# Altium schematic sheet MCU.SchDoc
size A4; SheetNumber: 3; SheetTotal: 7
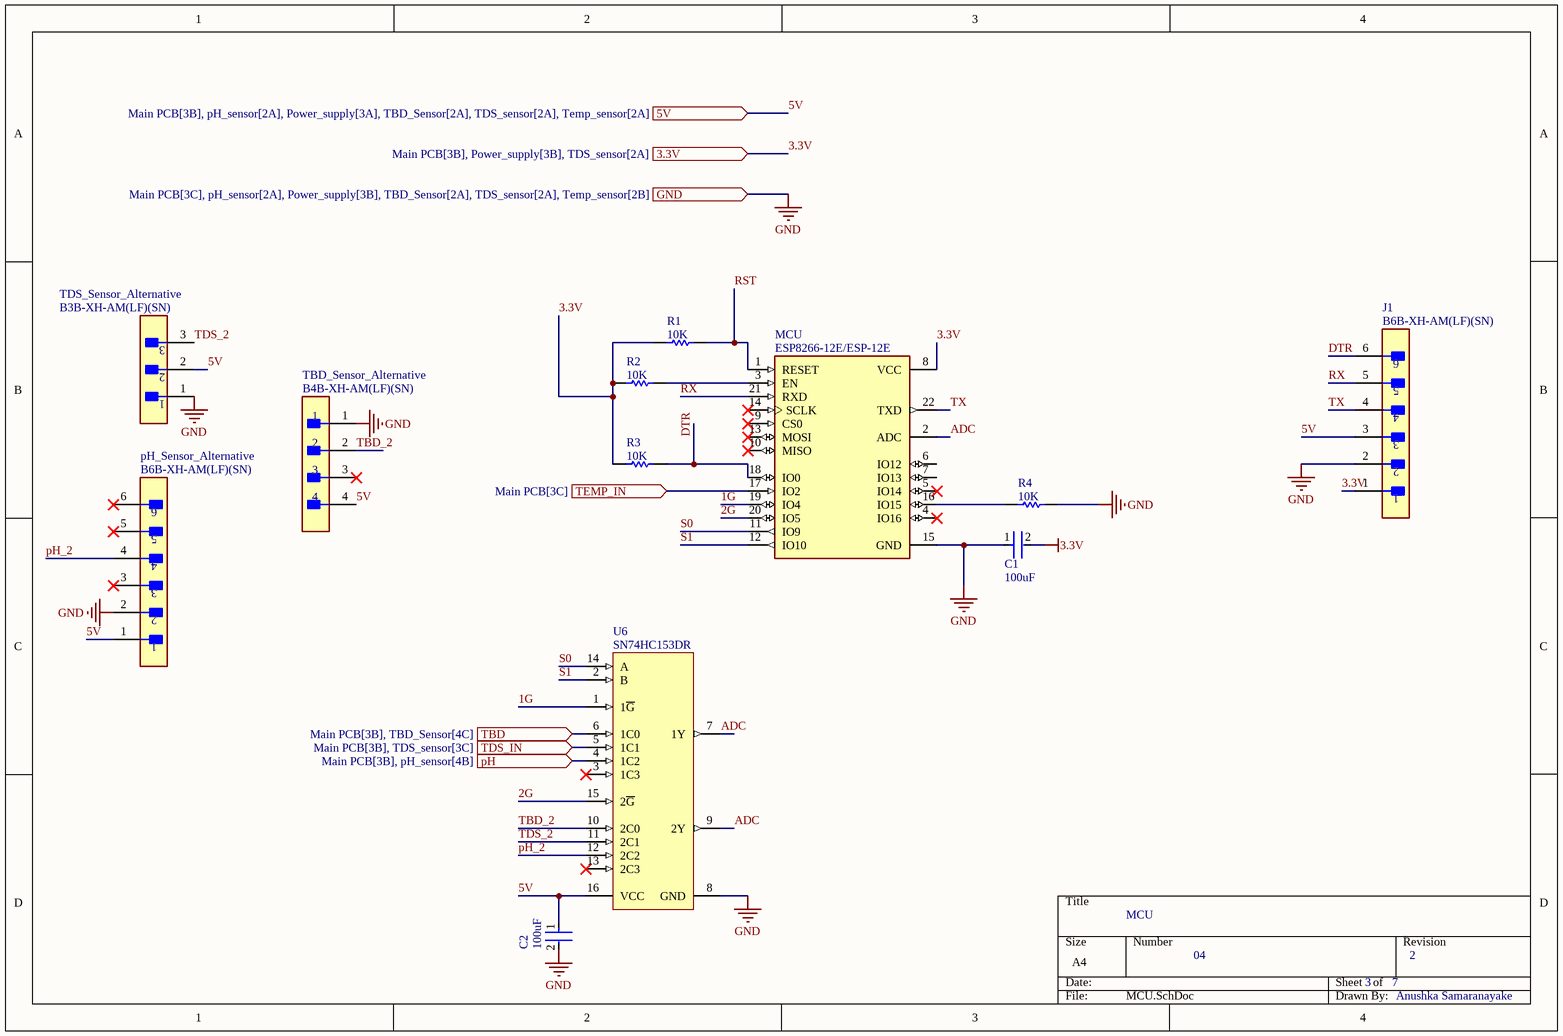
[diagram p0: MCU.SchDoc]

## Parts
C1  100uF  [FP-GRM31M-0_15-IPC_A]
C2  100uF  [FP-CL31-IPC_B]
J1  B6B-XH-AM(LF)(SN)  [FP-B6B-XH-AM_LF_SN-MFG]
MCU  ESP8266-12E/ESP-12E  [XCVR_ESP8266-12E/ESP-12E]
pH_Sensor_Alternative  B6B-XH-AM(LF)(SN)  [FP-B6B-XH-AM_LF_SN-MFG]
R1  10K  [RESC3216X70X50LL20T25]
R2  10K  [RESC3216X70X50LL20T25]
R3  10K  [RESC3216X70X50LL20T25]
R4  10K  [RESC3216X70X50LL20T25]
TBD_Sensor_Alternative  B4B-XH-AM(LF)(SN)  [FP-B4B-XH-AM_LF_SN-MFG]
TDS_Sensor_Alternative  B3B-XH-AM(LF)(SN)  [FP-B3B-XH-AM_LF_SN-MFG]
U6  SN74HC153DR  [D0016A_L]

## Ports
3.3V (in, see Main PCB[3B], Power_supply[3B], TDS_sensor[2A]), 5V (in, see Main PCB[3B], pH_sensor[2A], Power_supply[3A], TBD_Sensor[2A], TDS_sensor[2A], Temp_sensor[2A]), GND (in, see Main PCB[3C], pH_sensor[2A], Power_supply[3B], TBD_Sensor[2A], TDS_sensor[2A], Temp_sensor[2B]), pH (in, see Main PCB[3B], pH_sensor[4B]), TBD (in, see Main PCB[3B], TBD_Sensor[4C]), TDS_IN (in, see Main PCB[3B], TDS_sensor[3C]), TEMP_IN (in, see Main PCB[3C])

## Nets
3.3V: C1.2 J1.1 MCU.8(VCC) R1.2 R2.2 R3.2 ; port 3.3V
GND: C1.1 C2.2 J1.2 MCU.15(GND) pH_Sensor_Alternative.2 R4.1 TBD_Sensor_Alternative.1 TDS_Sensor_Alternative.1 U6.8(GND) ; port GND
1G: MCU.19(IO4) U6.1(1~{G})
2G: MCU.20(IO5) U6.15(2~{G})
5V: C2.1 J1.3 pH_Sensor_Alternative.1 TBD_Sensor_Alternative.4 TDS_Sensor_Alternative.2 U6.16(VCC) ; port 5V
ADC: MCU.2(ADC) U6.7(1Y) U6.9(2Y)
DTR: J1.6 MCU.18(IO0) R3.1
pH: U6.4(1C2) ; port pH
pH_2: pH_Sensor_Alternative.4 U6.12(2C2)
RST: MCU.1(RESET) R1.1
RX: J1.5 MCU.21(RXD)
S0: MCU.11(IO9) U6.14(A)
S1: MCU.12(IO10) U6.2(B)
TBD: U6.6(1C0) ; port TBD
TBD_2: TBD_Sensor_Alternative.2 U6.10(2C0)
TDS_2: TDS_Sensor_Alternative.3 U6.11(2C1)
TDS_IN: U6.5(1C1) ; port TDS_IN
TEMP_IN: MCU.17(IO2) ; port TEMP_IN
TX: J1.4 MCU.22(TXD)
NetMCU_3: MCU.3(EN) R2.1
NetMCU_16: MCU.16(IO15) R4.2

Not connected (* = marked no-connect by the designer): MCU 4(IO16)* 5(IO14)* 6(IO12) 7(IO13) 9(CS0)* 10(MISO)* 13(MOSI)* 14(SCLK)*; pH_Sensor_Alternative 3* 5* 6*; TBD_Sensor_Alternative 3*; U6 3(1C3)* 13(2C3)*

## Notes on the sheet
- MCU
- 04
- 3
- 7
- 2
- Anushka Samaranayake

## Library data of the parts
C1 = CMP-06035-007547-1: Chip Multilayer Ceramic Capacitors for General Purpose, 1206, 0.10uF, SL, +350/-1000ppm/°C, 5%, 50V; Capacitance: 100nF; Dissipation Factor: 0.025%; Packaging: Tape and Reel; Length: 0.126inch; Case Code (Imperial): 1206; Voltage Rating (DC): 50V; Max Operating Temperature: 125°C; Voltage: 50V; Height: 1.15mm; Width: 0.063inch; Voltage Rating: 50V; Tolerance: 5%; Min Operating Temperature: -55°C; Mount: Surface Mount; Dielectric Material: Ceramic; Termination: SMD/SMT; Depth: 1.6mm; Case Code (Metric): 3216; Case/Package: 1206; Temperature Coefficient: -1000ppm/°C; Thickness: 0.049inch
C2 = CMP-13271-001731-1: Cap Ceramic 100nF 50V X7R ±10% SMD 1206 +125°C Embossed T/R; Voltage: 50V; Thickness: 0.037inch; Lead Free: Lead Free; Length: 3.2mm; Min Operating Temperature: -55°C; Package Quantity: 15000; Packaging: Tape and Reel; Mount: Surface Mount; Depth: 1.6mm; Case/Package: 1206; Voltage Rating (DC): 50V; Tolerance: 10%; Height: 0.85mm; Capacitance: 100nF; Radiation Hardening: No; Dielectric: X7R; Voltage Rating: 50V; Max Operating Temperature: 125°C; Width: 0.063inch
J1 pH_Sensor_Alternative = CMP-17439-000167-1: CONN HEADER VERT 6POS 2.5MM; Shape: Straight; Current Rating: 3A; Mated Stacking Heights: 9.8mm; Number of Positions: 6; Voltage Rating: 250V; Pitch: 2.5mm; Insulation Color: Natural; Number of Pins: 6; Width: 5.75mm; Flammability Rating: UL94 V-0; Packaging: Bulk; Connector Type: Header; Number of Rows: 1; Contact Plating: Copper; Mount: Through Hole; Min Operating Temperature: -25°C; Contact Type: Male Pin; Contact Shape: Square; Fastening Type: Detent; Length: 17.4mm; Series: XH; Contact Finish - Mating: TIN; Max Operating Temperature: 85°C; Insulation Material: Nylon; Number of Poles: 6; Termination: Press-Fit; Contact Material: Brass; Height: 7mm
MCU = ESP8266-12E/ESP-12E: This WiFi module has a 32-bit MCU micro and clock speeds supporting 80 MHz or 160 MHz. Supports the RTOS and integrated Wi-Fi MAC/BB/RF/PA/LNA, and has an on-board antenna.; MF: AI-Thinker; Value: *; SnapEDA_Link: https://www.snapeda.com/parts/ESP8266-12E/ESP-12E/AI-Thinker/view-part/?ref=snap; Availability: Not in stock; Price: None; Package: None; Check_prices: https://www.snapeda.com/parts/ESP8266-12E/ESP-12E/AI-Thinker/view-part/?ref=eda; MP: ESP8266-12E/ESP-12E
R1-R4 = CMP-2003-04407-1: Manufacturer: Panasonic; Part Number: ERA8AEB103V
TBD_Sensor_Alternative = CMP-17439-000301-1: CONN HEADER VERT 4POS 2.5MM
TDS_Sensor_Alternative = CMP-17438-000009-1: CONN HEADER VERT 3POS 2.5MM; Max Current Rating: 3A; Gender: Male; Max Voltage Rating (AC): 250V; Connector Type: Male Pin; Pitch: 0.098inch; Number of Positions: 3; Contact Resistance: 20mR; Termination: Press-Fit; Housing Color: White; Housing Material: Polyamide; Orientation: Straight; Contact Material: Brass; Contact Type: Male Pin; Color: Natural; Packaging: Bulk; Lead Free: Lead Free; Depth: 5.75mm; Number of Rows: 1; Contact Plating: Tin; Length: 9.9mm; Max Operating Temperature: 85°C; Series: XH; Min Operating Temperature: -25°C; Fastening Type: Detent; Mount: Through Hole
U6 = CMP-1628-00005-2: Dual 4-Line To 1-Line Data Selectors/Multiplexers, D0016A, LARGE T&R; Manufacturer: Texas Instruments; tpd @ Nom Voltage(Max)(ns): 38; Configuration: 4：1; Channels(#): 2; Bits(#): 4; Function: Encoder/Multiplexer; Input Type: LVTTL/CMOS; VCC(Max)(V): 6; ICC @ Nom Voltage(Max)(mA): 8; Output Type: CMOS; Output Drive (IOL/IOH)(Max)(mA): 7.8/-7.8; Technology Family: HC; F @ Nom Voltage(Max)(Mhz): 28; Schmitt Trigger: No; Rating: Catalog; Voltage(Nom)(V): 3.3,5; Code_JEDEC: MS-012 variation AC; Operating Temperature Range(C): -40 to 85; DatasheetVersion: SCLS112D; Type: Standard; VCC(Min)(V): 2; Generic Part Number: SN74HC153; PackageReference: D0016A